# Altium schematic sheet JM320240D.SchDoc
size A4; Organization: Altium Limited; Address1: L3, 12a Rodborough Rd; Address2: Frenchs Forest; Address3: NSW; Address4: Australia 2086
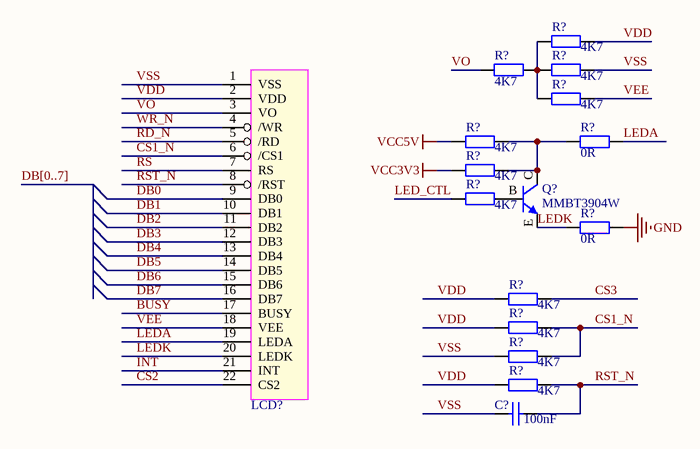
[diagram p0: JM320240D.SchDoc]

## Parts
(Parts that share a designator on the sheet are numbered #1, #2 ... from top to bottom, then left to right.)
C?  value 100nF  [R0402]  (hidden comment: CAP_04)
LCD?  CH240128B  (value not drawn)
Q?  MMBT3904W  [SOT_23]
R?#1  value 4K7  [R0402]  (hidden comment: RES_04)
R?#2  value 4K7  [R0402]  (hidden comment: RES_04)
R?#3  value 4K7  [R0402]  (hidden comment: RES_04)
R?#4  value 4K7  [R0402]  (hidden comment: RES_04)
R?#5  value 4K7  [R0402]  (hidden comment: RES_04)
R?#6  value 0R  [R0402]  (hidden comment: RES_04)
R?#7  value 4K7  [R0402]  (hidden comment: RES_04)
R?#8  value 4K7  [R0402]  (hidden comment: RES_04)
R?#9  value 0R  [R0402]  (hidden comment: RES_04)
R?#10  value 4K7  [R0402]  (hidden comment: RES_04)
R?#11  value 4K7  [R0402]  (hidden comment: RES_04)
R?#12  value 4K7  [R0402]  (hidden comment: RES_04)
R?#13  value 4K7  [R0402]  (hidden comment: RES_04)

## Nets
GND: R?#9.2
VCC3V3: R?#7.1
VCC5V: R?#5.1
BUSY: LCD?.17(BUSY)
CS1_N: LCD?.6(/CS1) R?#11.2 R?#12.2
CS2: LCD?.22(CS2)
CS3: R?#10.2
DB0: LCD?.9(DB0)
DB1: LCD?.10(DB1)
DB2: LCD?.11(DB2)
DB3: LCD?.12(DB3)
DB4: LCD?.13(DB4)
DB5: LCD?.14(DB5)
DB6: LCD?.15(DB6)
DB7: LCD?.16(DB7)
INT: LCD?.21(INT)
LED_CTL: R?#8.1
LEDA: LCD?.19(LEDA) R?#6.2
LEDK: LCD?.20(LEDK) Q?.E R?#9.1
RD_N: LCD?.5(/RD)
RS: LCD?.7(RS)
RST_N: C?.2 LCD?.8(/RST) R?#13.2
VDD: LCD?.2(VDD) R?#1.2 R?#10.1 R?#11.1 R?#13.1
VEE: LCD?.18(VEE) R?#4.2
VO: LCD?.3(VO) R?#2.1
VSS: C?.1 LCD?.1(VSS) R?#3.2 R?#12.1
WR_N: LCD?.4(/WR)
NetQ?_B: Q?.B R?#8.2
NetQ?_C: Q?.C R?#5.2 R?#6.1 R?#7.2
NetR?#1_1: R?#1.1 R?#2.2 R?#3.1 R?#4.1

## Buses and harness runs
bus DB[0..7]

## Notes on the sheet
- Title
- Size:
- Date:
- A4
- Number:
- Time:
- Revision:
- Sheet
- of
- File:

## Library data of the parts
Q? = MMBT3904TT1G
R?#1-R?#13 = RES_04: 0402电阻